# Altium project PS-010 Main.PrjPcb (part 1 of 2)
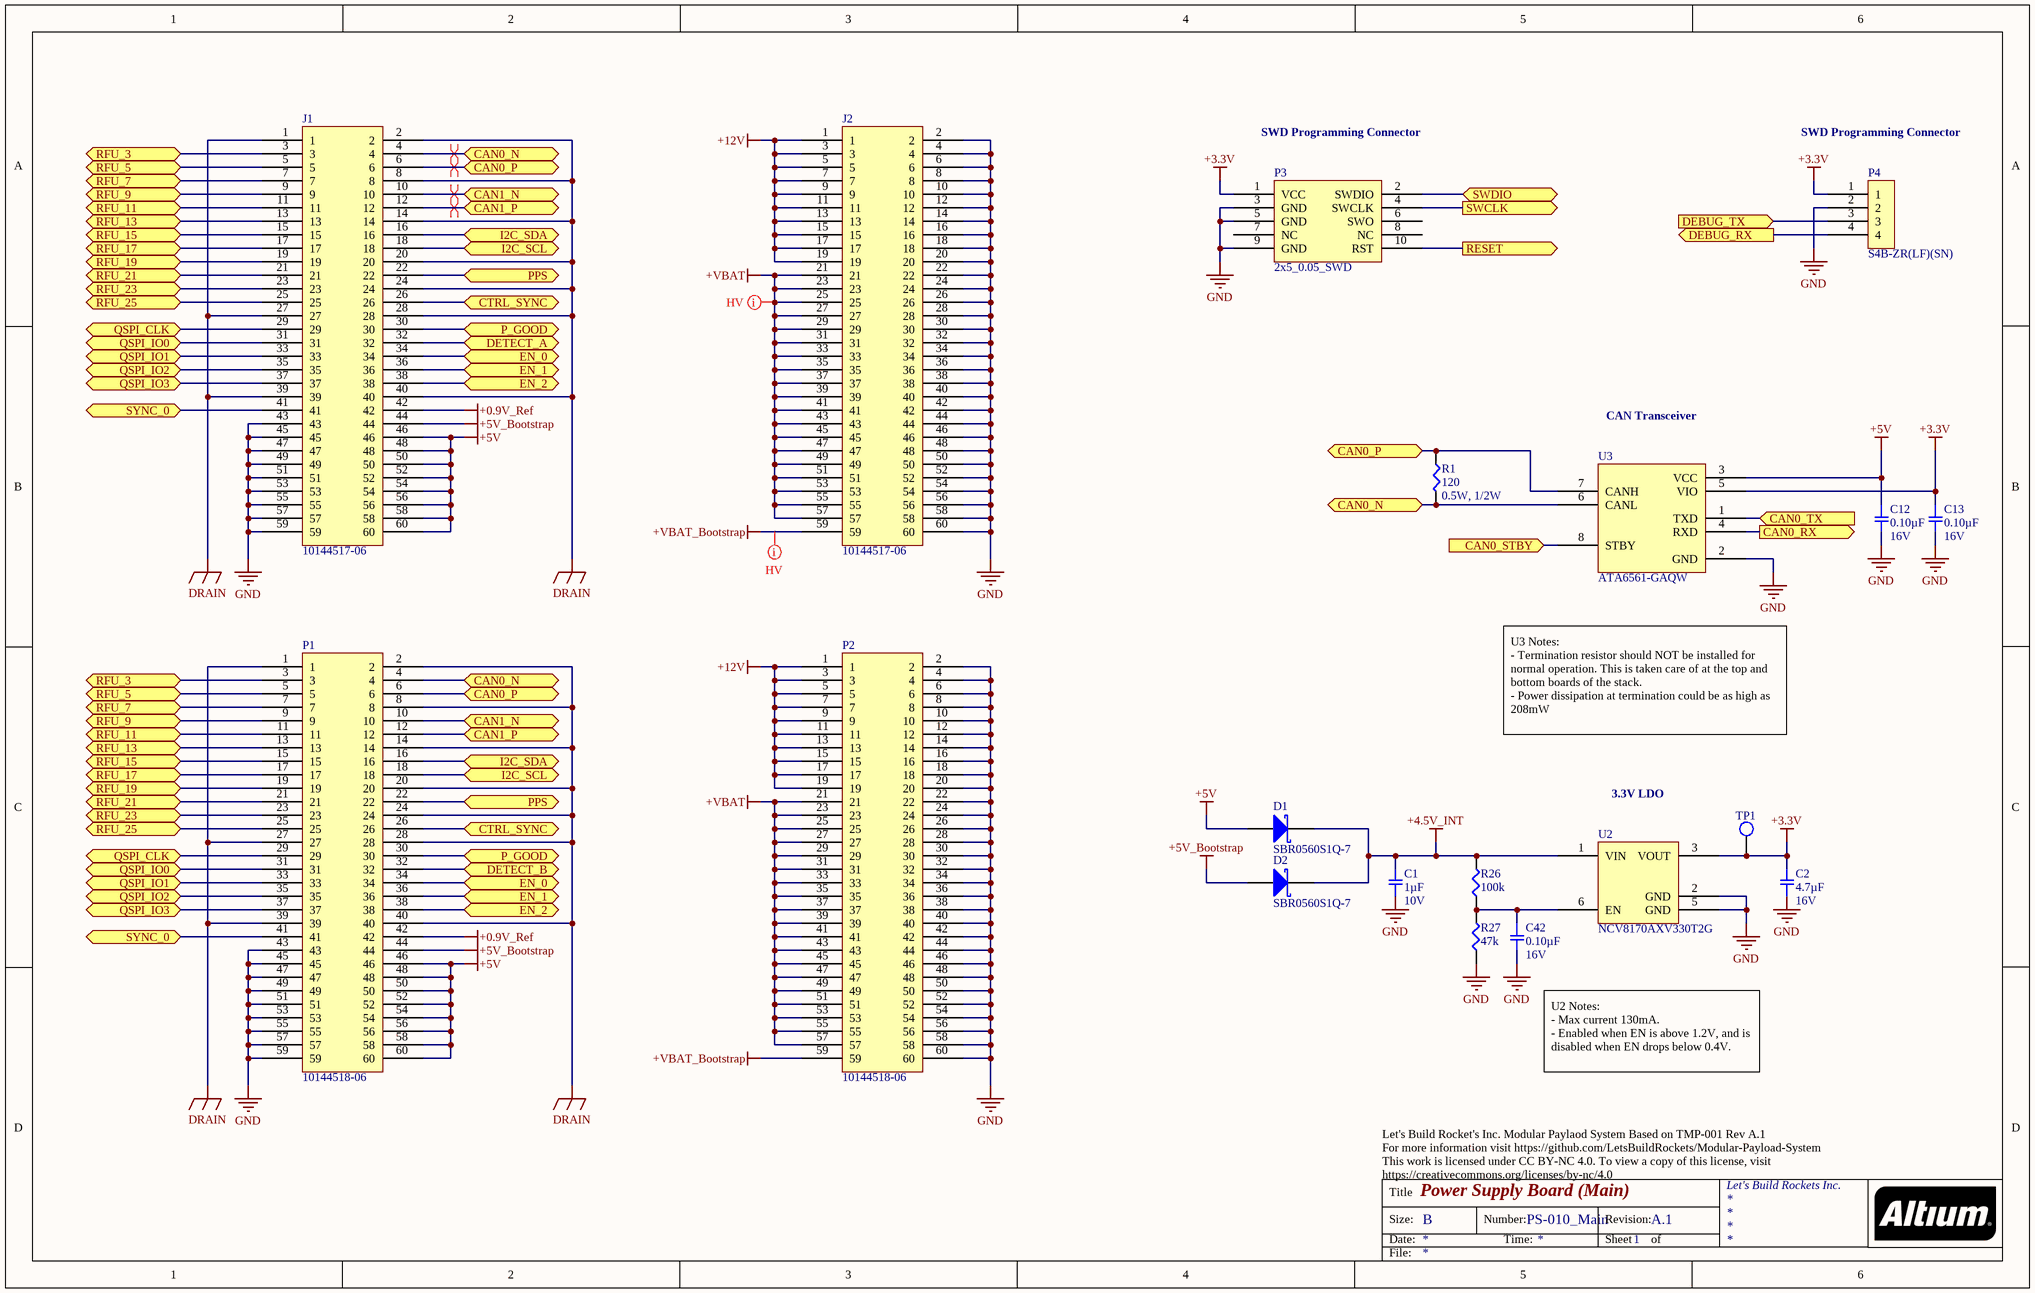
[diagram p0: Sheet1.SchDoc]
Title: Power Supply Board (Main); Revision: A.1; Organization: Let's Build Rockets Inc.; DocumentNumber: PS-010_Main
6 sheets, 144 parts. Net scope: flat (ports and power ports of the same name join across sheets).
Board file: PS-010 Main.PcbDoc
Sheets:
  Sheet1.SchDoc
  Sheet2.SchDoc
  Sheet3.SchDoc
  Sheet4.SchDoc
  Sheet5.SchDoc
  Sheet6.SchDoc

## Sheet Sheet1.SchDoc: Power Supply Board (Main)
size B; Organization: Let's Build Rockets Inc.; DocumentNumber: PS-010_Main; Revision: A.1; SheetNumber: 1

### Parts
C1  1µF  Voltage: 10V  [SMD-0402C]
C2  4.7µF  Voltage: 16V  [SMD-0805C]
C12  0.10µF  Voltage: 16V  [SMD-0402C]
C13  0.10µF  Voltage: 16V  [SMD-0402C]
C42  0.10µF  Voltage: 16V  [SMD-0402C]
D1  SBR0560S1Q-7  [SOD123]
D2  SBR0560S1Q-7  [SOD123]
J1  10144517-06  [10144517-062802LF]
J2  10144517-06  [10144517-062802LF]
P1  10144518-06  [10144518-064802LF]
P2  10144518-06  [10144518-064802LF]
P3  2x5_0.05_SWD  [2x5_0.05_R]
P4  S4B-ZR(LF)(SN)  [S4B-ZR(LF)(SN)]
R1  120  Power (Watts): 0.5W, 1/2W  [SMD-0805-RES]
R26  100k  [SMD-0402-RES]
R27  47k  [SMD-0402-RES]
TP1  TP  [TP_SMD_40]  (value not drawn)  (no BOM)
U2  NCV8170AXV330T2G  [SOTFL50P160X60-6N]
U3  ATA6561-GAQW  [SOIC127P600X175-8N]

### Ports
CAN0_N (bidir), CAN0_P (bidir), CAN0_RX (out), CAN0_STBY (in), CAN0_TX (in), CAN1_N (bidir), CAN1_P (bidir), CTRL_SYNC (bidir), DEBUG_RX (out), DEBUG_TX (in), DETECT_A (bidir), DETECT_B (bidir), EN_0 (bidir), EN_1 (bidir), EN_2 (bidir), I2C_SCL (bidir), I2C_SDA (bidir), P_GOOD (bidir), PPS (bidir), QSPI_CLK (bidir), QSPI_IO0 (bidir), QSPI_IO1 (bidir), QSPI_IO2 (bidir), QSPI_IO3 (bidir), RESET (out), RFU_3 (bidir), RFU_5 (bidir), RFU_7 (bidir), RFU_9 (bidir), RFU_11 (bidir), RFU_13 (bidir), RFU_15 (bidir), RFU_17 (bidir), RFU_19 (bidir), RFU_21 (bidir), RFU_23 (bidir), RFU_25 (bidir), SWCLK (out), SWDIO (bidir), SYNC_0 (bidir)

### Nets
+0.9V_Ref: J1.42 P1.42
+3.3V: C2.2 C13.1 P3.1(VCC) P4.1 TP1.1 U2.3(VOUT) U3.5(VIO)
+4.5V_INT: C1.2 D1.K D2.K R26.2 U2.1(VIN)
+5V: C12.1 D1.A J1.46 J1.48 J1.50 J1.52 J1.54 J1.56 J1.58 J1.60 P1.46 P1.48 P1.50 P1.52 P1.54 P1.56 P1.58 P1.60 U3.3(VCC)
+5V_Bootstrap: D2.A J1.44 P1.44
+12V: J2.1 J2.3 J2.5 J2.7 J2.9 J2.11 J2.13 J2.15 J2.17 J2.19 P2.1 P2.3 P2.5 P2.7 P2.9 P2.11 P2.13 P2.15 P2.17 P2.19
+VBAT: J2.21 J2.23 J2.25 J2.27 J2.29 J2.31 J2.33 J2.35 J2.37 J2.39 J2.41 J2.43 J2.45 J2.47 J2.49 J2.51 J2.53 J2.55 J2.57 P2.21 P2.23 P2.25 P2.27 P2.29 P2.31 P2.33 P2.35 P2.37 P2.39 P2.41 P2.43 P2.45 P2.47 P2.49 P2.51 P2.53 P2.55 P2.57
+VBAT_Bootstrap: J2.59 P2.59
DRAIN: J1.1 J1.2 J1.8 J1.14 J1.20 J1.24 J1.27 J1.28 J1.39 J1.40 P1.1 P1.2 P1.8 P1.14 P1.20 P1.24 P1.27 P1.28 P1.39 P1.40
GND: C1.1 C2.1 C12.2 C13.2 C42.2 J1.43 J1.45 J1.47 J1.49 J1.51 J1.53 J1.55 J1.57 J1.59 J2.2 J2.4 J2.6 J2.8 J2.10 J2.12 J2.14 J2.16 J2.18 J2.20 J2.22 J2.24 J2.26 J2.28 J2.30 J2.32 J2.34 J2.36 J2.38 J2.40 J2.42 J2.44 J2.46 J2.48 J2.50 J2.52 J2.54 J2.56 J2.58 J2.60 P1.43 P1.45 P1.47 P1.49 P1.51 P1.53 P1.55 P1.57 P1.59 P2.2 P2.4 P2.6 P2.8 P2.10 P2.12 P2.14 P2.16 P2.18 P2.20 P2.22 P2.24 P2.26 P2.28 P2.30 P2.32 P2.34 P2.36 P2.38 P2.40 P2.42 P2.44 P2.46 P2.48 P2.50 P2.52 P2.54 P2.56 P2.58 P2.60 P3.3(GND) P3.5(GND) P3.9(GND) P4.2 R27.1 U2.2(GND) U2.5(GND) U3.2(GND)
CAN0_N: J1.4 P1.4 R1.2 U3.6(CANL) ; port CAN0_N
CAN0_P: J1.6 P1.6 R1.1 U3.7(CANH) ; port CAN0_P
CAN0_RX: U3.4(RXD) ; port CAN0_RX
CAN0_STBY: U3.8(STBY) ; port CAN0_STBY
CAN0_TX: U3.1(TXD) ; port CAN0_TX
CAN1_N: J1.10 P1.10 ; port CAN1_N
CAN1_P: J1.12 P1.12 ; port CAN1_P
CTRL_SYNC: J1.26 P1.26 ; port CTRL_SYNC
DEBUG_RX: P4.4 ; port DEBUG_RX
DEBUG_TX: P4.3 ; port DEBUG_TX
DETECT_A: J1.32 ; port DETECT_A
DETECT_B: P1.32 ; port DETECT_B
EN_0: J1.34 P1.34 ; port EN_0
EN_1: J1.36 P1.36 ; port EN_1
EN_2: J1.38 P1.38 ; port EN_2
I2C_SCL: J1.18 P1.18 ; port I2C_SCL
I2C_SDA: J1.16 P1.16 ; port I2C_SDA
P_GOOD: J1.30 P1.30 ; port P_GOOD
PPS: J1.22 P1.22 ; port PPS
QSPI_CLK: J1.29 P1.29 ; port QSPI_CLK
QSPI_IO0: J1.31 P1.31 ; port QSPI_IO0
QSPI_IO1: J1.33 P1.33 ; port QSPI_IO1
QSPI_IO2: J1.35 P1.35 ; port QSPI_IO2
QSPI_IO3: J1.37 P1.37 ; port QSPI_IO3
RESET: P3.10(RST) ; port RESET
RFU_3: J1.3 P1.3 ; port RFU_3
RFU_5: J1.5 P1.5 ; port RFU_5
RFU_7: J1.7 P1.7 ; port RFU_7
RFU_9: J1.9 P1.9 ; port RFU_9
RFU_11: J1.11 P1.11 ; port RFU_11
RFU_13: J1.13 P1.13 ; port RFU_13
RFU_15: J1.15 P1.15 ; port RFU_15
RFU_17: J1.17 P1.17 ; port RFU_17
RFU_19: J1.19 P1.19 ; port RFU_19
RFU_21: J1.21 P1.21 ; port RFU_21
RFU_23: J1.23 P1.23 ; port RFU_23
RFU_25: J1.25 P1.25 ; port RFU_25
SWCLK: P3.4(SWCLK) ; port SWCLK
SWDIO: P3.2(SWDIO) ; port SWDIO
SYNC_0: J1.41 P1.41 ; port SYNC_0
NetC42_1: C42.1 R26.1 R27.2 U2.6(EN)

Not connected (* = marked no-connect by the designer): P3 6(SWO) 7(NC) 8(NC)

### Layout directives
differential pair: CAN0_N, CAN0_P, CAN1_N, CAN1_P
net class HIghVoltage: +VBAT, +VBAT_Bootstrap

### Notes on the sheet
- SWD Programming Connector
- CAN Transceiver
- U3 Notes:
  - Termination resistor should NOT be installed for normal operation. This is taken care of at the top and bottom boards of the stack.
  - Power dissipation at termination could be as high as 208mW
- 3.3V LDO
- (near C42) U2 Notes:
  - Max current 130mA.
  - Enabled when EN is above 1.2V, and is disabled when EN drops below 0.4V.
- Let's Build Rocket's Inc. Modular Paylaod System Based on TMP-001 Rev A.1
  For more information visit https://github.com/LetsBuildRockets/Modular-Payload-System
  This work is licensed under CC BY-NC 4.0. To view a copy of this license, visit https://creativecommons.org/licenses/by-nc/4.0
- Title
- Size:
- Date:
- B
- Number:
- Time:
- Revision:
- Sheet
- of
- File:

### Library data of the parts
C1 = GCM155C71A105KE38D: CAP CER 1UF 10V X7S 0402; Manufacturer: Murata Electronics North America; Factory Stock: 0; Unit Price (USD): 0.12; Minimum Quantity: 1; Tolerance: ±10%; Datasheets: http://www.murata.com/~/media/webrenewal/support/library/catalog/products/capacitor/mlcc/c03e.ashx; Image: //media.digikey.com/Renders/Murata%20Renders/ZRB-SERIES-0402.jpg; Digi-Key Part Number: 490-13409-1-ND; Part Number: GCM155C71A105KE38D; Quantity Available: 7240; @ qty: 0; Packaging: Cut Tape (CT); Series: GCM; Part Status: Active; Value: 1µF; Temperature Coefficient: X7S; Operating Temperature: -55°C ~ 125°C; Features: -; Ratings: AEC-Q200; Applications: Automotive; Mounting Type: Surface Mount, MLCC; Package / Case: 0402 (1005 Metric); Size / Dimension: 0.039" L x 0.020" W (1.00mm x 0.50mm); Height - Seated (Max): -; Thickness (Max): 0.022" (0.55mm); Lead Spacing: -; Lead Style: -
C2 = GCJ21BR71C475KA01L: CAP CER 4.7UF 16V X7R 0805; Manufacturer: Murata Electronics North America; Factory Stock: 0; Unit Price (USD): 0.44; Minimum Quantity: 1; Tolerance: ±10%; Datasheets: http://www.murata.com/~/media/webrenewal/support/library/catalog/products/capacitor/mlcc/c03e.ashx; Image: //media.digikey.com/Renders/Murata%20Renders/0805%20(2012%20Metric)%20.85mm.jpg; Digi-Key Part Number: 490-10557-1-ND; Part Number: GCJ21BR71C475KA01L; Quantity Available: 53217; @ qty: 0; Packaging: Cut Tape (CT); Series: GCJ; Part Status: Active; Value: 4.7µF; Temperature Coefficient: X7R; Operating Temperature: -55°C ~ 125°C; Features: Soft Termination; Ratings: AEC-Q200; Applications: Automotive, Boardflex Sensitive; Mounting Type: Surface Mount, MLCC; Package / Case: 0805 (2012 Metric); Size / Dimension: 0.079" L x 0.049" W (2.00mm x 1.25mm); Height - Seated (Max): -; Thickness (Max): 0.057" (1.45mm); Lead Spacing: -; Lead Style: -
C12 C13 C42 = GCM155R71C104KA55D: CAP CER 0.1UF 16V X7R 0402; Manufacturer: Murata Electronics North America; Factory Stock: 0; Unit Price (USD): 0.1; Minimum Quantity: 1; Tolerance: ±10%; Datasheets: http://www.murata.com/~/media/webrenewal/support/library/catalog/products/capacitor/mlcc/c03e.ashx; Image: //media.digikey.com/Renders/Murata%20Renders/ZRB-SERIES-0402.jpg; Digi-Key Part Number: 490-4759-1-ND; Part Number: GCM155R71C104KA55D; Quantity Available: 734194; @ qty: 0; Packaging: Cut Tape (CT); Series: GCM; Part Status: Active; Value: 0.10µF; Temperature Coefficient: X7R; Operating Temperature: -55°C ~ 125°C; Features: -; Ratings: AEC-Q200; Applications: Automotive; Mounting Type: Surface Mount, MLCC; Package / Case: 0402 (1005 Metric); Size / Dimension: 0.039" L x 0.020" W (1.00mm x 0.50mm); Height - Seated (Max): -; Thickness (Max): 0.022" (0.55mm); Lead Spacing: -; Lead Style: -
R1 = ERJ-P6WJ121V: RES SMD 120 OHM 5% 1/2W 0805; Manufacturer: Panasonic Electronic Components; Factory Stock: 0; Unit Price (USD): 0.08237; @ qty: 1500; Minimum Quantity: 1; Temperature Coefficient: ±200ppm/°C; Part Number: ERJ-P6WJ121V; Datasheets: https://industrial.panasonic.com/cdbs/www-data/pdf/RDA0000/AOA0000C243.pdf; Image: //media.digikey.com/Renders/Panasonic%20Renders/ERJ-0805%20Pkg.jpg; Digi-Key Part Number: P16943CT-ND; Quantity Available: 4133; Packaging: Cut Tape (CT); Series: ERJ; Part Status: Active; Value: 120; Tolerance: ±5%; Composition: Thick Film; Features: Automotive AEC-Q200, Pulse Withstanding; Operating Temperature: -55°C ~ 155°C; Package / Case: 0805 (2012 Metric); Supplier Device Package: 0805; Size / Dimension: 0.079" L x 0.049" W (2.00mm x 1.25mm); Height - Seated (Max): 0.030" (0.75mm); Number of Terminations: 2; Failure Rate: -
R26 = ERJ-2GEJ104X: RES SMD 100K OHM 5% 1/10W 0402; Manufacturer: Panasonic Electronic Components; Factory Stock: 0; Unit Price (USD): 0.00350; @ qty: 1500; Minimum Quantity: 1; Power (Watts): 0.1W, 1/10W; Temperature Coefficient: ±200ppm/°C; Part Number: ERJ-2GEJ104X; Datasheets: http://industrial.panasonic.com/www-cgi/jvcr13pz.cgi?E+PZ+3+AOA0001+ERJ2GEJ104X+7+WW; Image: //media.digikey.com/Photos/Panasonic%20Photos/ERJ-PA2-Series.jpg; Digi-Key Part Number: P100KJCT-ND; Quantity Available: 2387986; Packaging: Cut Tape (CT); Series: ERJ; Part Status: Active; Value: 100k; Tolerance: ±5%; Composition: Thick Film; Features: Automotive AEC-Q200; Operating Temperature: -55°C ~ 155°C; Package / Case: 0402 (1005 Metric); Supplier Device Package: 0402; Size / Dimension: 0.039" L x 0.020" W (1.00mm x 0.50mm); Height - Seated (Max): 0.016" (0.40mm); Number of Terminations: 2; Failure Rate: -
R27 = ERJ-2GEJ473X: RES SMD 47K OHM 5% 1/10W 0402; Manufacturer: Panasonic Electronic Components; Factory Stock: 0; Unit Price (USD): 0.00350; @ qty: 1500; Minimum Quantity: 1; Power (Watts): 0.1W, 1/10W; Temperature Coefficient: ±200ppm/°C; Part Number: ERJ-2GEJ473X; Datasheets: http://industrial.panasonic.com/www-cgi/jvcr13pz.cgi?E+PZ+3+AOA0001+ERJ2GEJ473X+7+WW; Image: //media.digikey.com/Photos/Panasonic%20Photos/ERJ-PA2-Series.jpg; Digi-Key Part Number: P47KJCT-ND; Quantity Available: 5182645; Packaging: Cut Tape (CT); Series: ERJ; Part Status: Active; Value: 47k; Tolerance: ±5%; Composition: Thick Film; Features: Automotive AEC-Q200; Operating Temperature: -55°C ~ 155°C; Package / Case: 0402 (1005 Metric); Supplier Device Package: 0402; Size / Dimension: 0.039" L x 0.020" W (1.00mm x 0.50mm); Height - Seated (Max): 0.016" (0.40mm); Number of Terminations: 2; Failure Rate: -

## Sheet Sheet2.SchDoc: Power Supply Board (Main)
size B; Organization: Let's Build Rockets Inc.; DocumentNumber: PS-010_Main; Revision: A.1; SheetNumber: 2
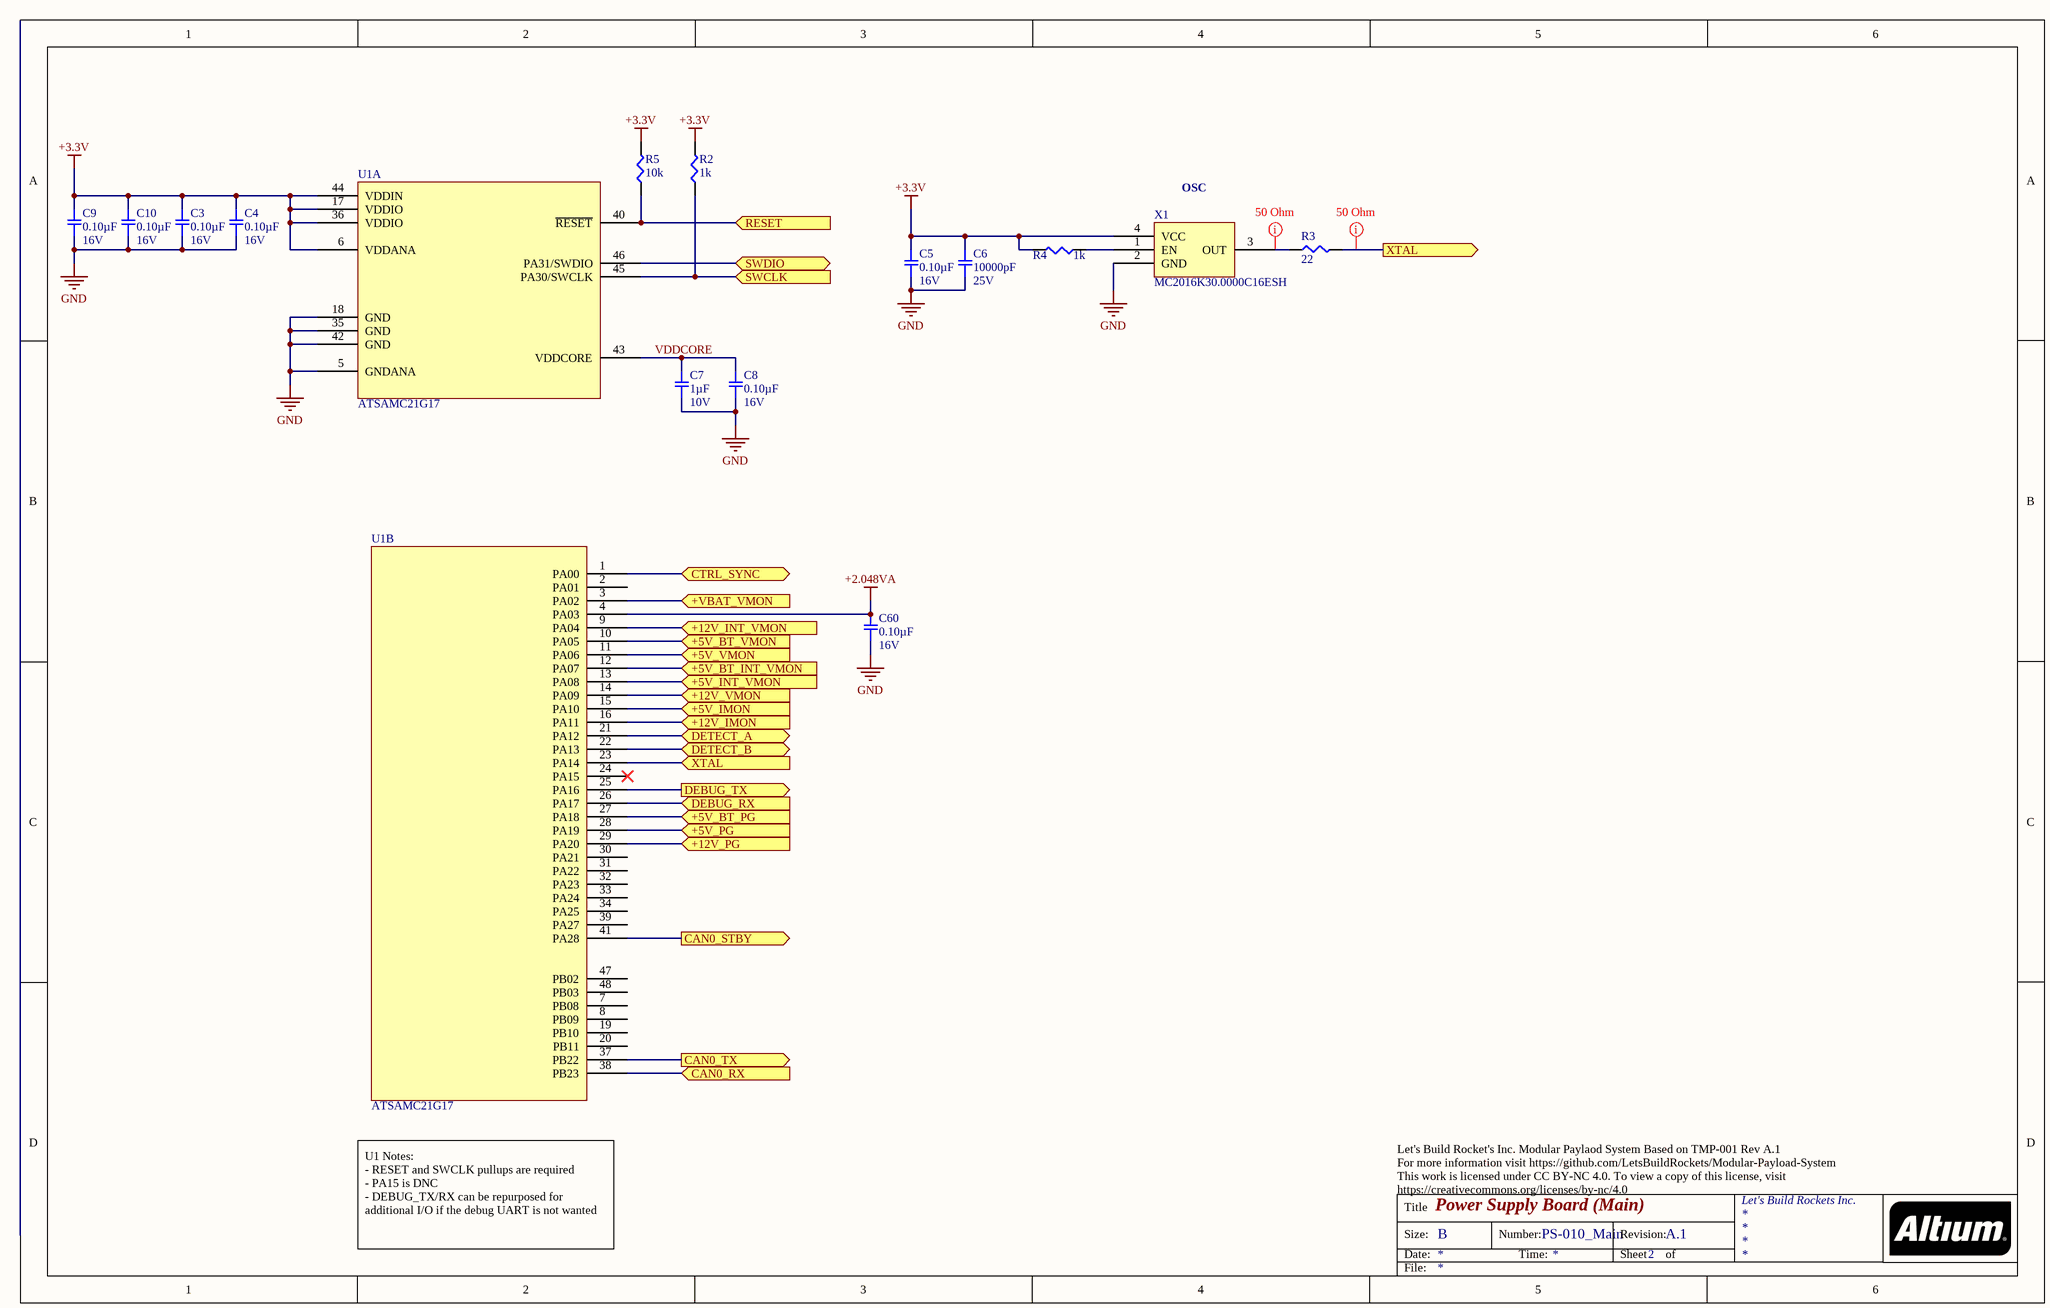
[diagram p1: Sheet2.SchDoc]

### Parts
C3  0.10µF  Voltage: 16V  [SMD-0402C]
C4  0.10µF  Voltage: 16V  [SMD-0402C]
C5  0.10µF  Voltage: 16V  [SMD-0402C]
C6  10000pF  Voltage: 25V  [SMD-0402C]
C7  1µF  Voltage: 10V  [SMD-0402C]
C8  0.10µF  Voltage: 16V  [SMD-0402C]
C9  0.10µF  Voltage: 16V  [SMD-0402C]
C10  0.10µF  Voltage: 16V  [SMD-0402C]
C60  0.10µF  Voltage: 16V  [SMD-0402C]
R2  1k  [SMD-0402-RES]
R3  22  [SMD-0402-RES]
R4  1k  [SMD-0402-RES]
R5  10k  [SMD-0402-RES]
U1  ATSAMC21G17  [TSQFP50P900X900X120-48N]  (parts A,B of 2)
X1  MC2016K30.0000C16ESH  [MC2016]

### Ports
+5V_BT_INT_VMON (in), +5V_BT_PG (in), +5V_BT_VMON (in), +5V_IMON (in), +5V_INT_VMON (in), +5V_PG (in), +5V_VMON (in), +12V_IMON (in), +12V_INT_VMON (in), +12V_PG (in), +12V_VMON (in), +VBAT_VMON (in), CAN0_RX (in), CAN0_STBY (out), CAN0_TX (out), CTRL_SYNC (bidir), DEBUG_RX (in), DEBUG_TX (out), DETECT_A (bidir), DETECT_B (bidir), RESET (in), SWCLK (in), SWDIO (bidir), XTAL (in), XTAL (out)

### Nets
+2.048VA: C60.2 U1.4(PA03)
+3.3V: C3.2 C4.2 C5.2 C6.2 C9.2 C10.2 R2.2 R4.2 R5.2 U1.6(VDDANA) U1.17(VDDIO) U1.36(VDDIO) U1.44(VDDIN) X1.4(VCC)
GND: C3.1 C4.1 C5.1 C6.1 C7.1 C8.1 C9.1 C10.1 C60.1 U1.5(GNDANA) U1.18(GND) U1.35(GND) U1.42(GND) X1.2(GND)
+5V_BT_INT_VMON: U1.12(PA07) ; port +5V_BT_INT_VMON
+5V_BT_PG: U1.27(PA18) ; port +5V_BT_PG
+5V_BT_VMON: U1.10(PA05) ; port +5V_BT_VMON
+5V_IMON: U1.15(PA10) ; port +5V_IMON
+5V_INT_VMON: U1.13(PA08) ; port +5V_INT_VMON
+5V_PG: U1.28(PA19) ; port +5V_PG
+5V_VMON: U1.11(PA06) ; port +5V_VMON
+12V_IMON: U1.16(PA11) ; port +12V_IMON
+12V_INT_VMON: U1.9(PA04) ; port +12V_INT_VMON
+12V_PG: U1.29(PA20) ; port +12V_PG
+12V_VMON: U1.14(PA09) ; port +12V_VMON
+VBAT_VMON: U1.3(PA02) ; port +VBAT_VMON
CAN0_RX: U1.38(PB23) ; port CAN0_RX
CAN0_STBY: U1.41(PA28) ; port CAN0_STBY
CAN0_TX: U1.37(PB22) ; port CAN0_TX
CTRL_SYNC: U1.1(PA00) ; port CTRL_SYNC
DEBUG_RX: U1.26(PA17) ; port DEBUG_RX
DEBUG_TX: U1.25(PA16) ; port DEBUG_TX
DETECT_A: U1.21(PA12) ; port DETECT_A
DETECT_B: U1.22(PA13) ; port DETECT_B
RESET: R5.1 U1.40(~{RESET}) ; port RESET
SWCLK: R2.1 U1.45(PA30/SWCLK) ; port SWCLK
SWDIO: U1.46(PA31/SWDIO) ; port SWDIO
VDDCORE: C7.2 C8.2 U1.43(VDDCORE)
XTAL: R3.2 U1.23(PA14) ; port XTAL
NetR3_1: R3.1 X1.3(OUT)
NetR4_1: R4.1 X1.1(EN)

Not connected (* = marked no-connect by the designer): U1 2(PA01) 7(PB08) 8(PB09) 19(PB10) 20(PB11) 24(PA15)* 30(PA21) 31(PA22) 32(PA23) 33(PA24) 34(PA25) 39(PA27) 47(PB02) 48(PB03)

### Layout directives
rule Width Constraint [Pref Impedance = 50.00ohms    Min Impedance = 50.00ohms    Max Impedance = 50.00ohms]: NetR3_1, XTAL

### Notes on the sheet
- (near X1) OSC
- Let's Build Rocket's Inc. Modular Paylaod System Based on TMP-001 Rev A.1
  For more information visit https://github.com/LetsBuildRockets/Modular-Payload-System
  This work is licensed under CC BY-NC 4.0. To view a copy of this license, visit https://creativecommons.org/licenses/by-nc/4.0
- U1 Notes:
  - RESET and SWCLK pullups are required
  - PA15 is DNC
  - DEBUG_TX/RX can be repurposed for additional I/O if the debug UART is not wanted
- Title
- Size:
- Date:
- B
- Number:
- Time:
- Revision:
- Sheet
- of
- File:

### Library data of the parts
C3-C5 C8-C10 C60 = GCM155R71C104KA55D: as C12 on sheet Sheet1; Datasheets: http://www.murata.com/~/media/webrenewal/support/library/catalog/products/capacitor/mlcc/c03e.ashx; Image: //media.digikey.com/Renders/Murata%20Renders/ZRB-SERIES-0402.jpg; Digi-Key Part Number: 490-4759-1-ND; Part Number: GCM155R71C104KA55D; Quantity Available: 734194; @ qty: 0; Packaging: Cut Tape (CT); Series: GCM; Part Status: Active; Value: 0.10µF; Temperature Coefficient: X7R; Operating Temperature: -55°C ~ 125°C; Features: -; Ratings: AEC-Q200; Applications: Automotive; Mounting Type: Surface Mount, MLCC; Package / Case: 0402 (1005 Metric); Size / Dimension: 0.039" L x 0.020" W (1.00mm x 0.50mm); Height - Seated (Max): -; Thickness (Max): 0.022" (0.55mm); Lead Spacing: -; Lead Style: -
C6 = GCM155R71E103KA37D: CAP CER 10000PF 25V X7R 0402; Manufacturer: Murata Electronics North America; Factory Stock: 0; Unit Price (USD): 0.1; Minimum Quantity: 1; Tolerance: ±10%; Datasheets: http://www.murata.com/~/media/webrenewal/support/library/catalog/products/capacitor/mlcc/c03e.ashx; Image: //media.digikey.com/Renders/Murata%20Renders/ZRB-SERIES-0402.jpg; Digi-Key Part Number: 490-6043-1-ND; Part Number: GCM155R71E103KA37D; Quantity Available: 128782; @ qty: 0; Packaging: Cut Tape (CT); Series: GCM; Part Status: Active; Value: 10000pF; Temperature Coefficient: X7R; Operating Temperature: -55°C ~ 125°C; Features: -; Ratings: AEC-Q200; Applications: Automotive; Mounting Type: Surface Mount, MLCC; Package / Case: 0402 (1005 Metric); Size / Dimension: 0.039" L x 0.020" W (1.00mm x 0.50mm); Height - Seated (Max): -; Thickness (Max): 0.022" (0.55mm); Lead Spacing: -; Lead Style: -
C7 = GCM155C71A105KE38D: as C1 on sheet Sheet1; Datasheets: http://www.murata.com/~/media/webrenewal/support/library/catalog/products/capacitor/mlcc/c03e.ashx; Image: //media.digikey.com/Renders/Murata%20Renders/ZRB-SERIES-0402.jpg; Digi-Key Part Number: 490-13409-1-ND; Part Number: GCM155C71A105KE38D; Quantity Available: 7240; @ qty: 0; Packaging: Cut Tape (CT); Series: GCM; Part Status: Active; Value: 1µF; Temperature Coefficient: X7S; Operating Temperature: -55°C ~ 125°C; Features: -; Ratings: AEC-Q200; Applications: Automotive; Mounting Type: Surface Mount, MLCC; Package / Case: 0402 (1005 Metric); Size / Dimension: 0.039" L x 0.020" W (1.00mm x 0.50mm); Height - Seated (Max): -; Thickness (Max): 0.022" (0.55mm); Lead Spacing: -; Lead Style: -
R2 R4 = ERJ-2GEJ102X: RES SMD 1K OHM 5% 1/10W 0402; Manufacturer: Panasonic Electronic Components; Factory Stock: 0; Unit Price (USD): 0.00350; @ qty: 1500; Minimum Quantity: 1; Power (Watts): 0.1W, 1/10W; Temperature Coefficient: ±200ppm/°C; Part Number: ERJ-2GEJ102X; Datasheets: http://industrial.panasonic.com/www-cgi/jvcr13pz.cgi?E+PZ+3+AOA0001+ERJ2GEJ102X+7+WW; Image: //media.digikey.com/Photos/Panasonic%20Photos/ERJ-PA2-Series.jpg; Digi-Key Part Number: P1.0KJCT-ND; Quantity Available: 1939857; Packaging: Cut Tape (CT); Series: ERJ; Part Status: Active; Value: 1k; Tolerance: ±5%; Composition: Thick Film; Features: Automotive AEC-Q200; Operating Temperature: -55°C ~ 155°C; Package / Case: 0402 (1005 Metric); Supplier Device Package: 0402; Size / Dimension: 0.039" L x 0.020" W (1.00mm x 0.50mm); Height - Seated (Max): 0.016" (0.40mm); Number of Terminations: 2; Failure Rate: -
R3 = ERJ-2RKF22R0X: RES SMD 22 OHM 1% 1/10W 0402; Manufacturer: Panasonic Electronic Components; Factory Stock: 0; Unit Price (USD): 0.00496; @ qty: 1500; Minimum Quantity: 1; Power (Watts): 0.1W, 1/10W; Temperature Coefficient: ±100ppm/°C; Part Number: ERJ-2RKF22R0X; Datasheets: http://industrial.panasonic.com/www-cgi/jvcr13pz.cgi?E+PZ+3+AOA0002+ERJ2RKF22R0X+7+WW; Image: //media.digikey.com/Photos/Panasonic%20Photos/ERJ-PA2-Series.jpg; Digi-Key Part Number: P22.0LCT-ND; Quantity Available: 620432; Packaging: Cut Tape (CT); Series: ERJ; Part Status: Active; Value: 22; Tolerance: ±1%; Composition: Thick Film; Features: Automotive AEC-Q200; Operating Temperature: -55°C ~ 155°C; Package / Case: 0402 (1005 Metric); Supplier Device Package: 0402; Size / Dimension: 0.039" L x 0.020" W (1.00mm x 0.50mm); Height - Seated (Max): 0.016" (0.40mm); Number of Terminations: 2; Failure Rate: -
R5 = ERJ-2GEJ103X: RES SMD 10K OHM 5% 1/10W 0402; Manufacturer: Panasonic Electronic Components; Factory Stock: 0; Unit Price (USD): 0.00350; @ qty: 1500; Minimum Quantity: 1; Power (Watts): 0.1W, 1/10W; Temperature Coefficient: ±200ppm/°C; Part Number: ERJ-2GEJ103X; Datasheets: http://industrial.panasonic.com/www-cgi/jvcr13pz.cgi?E+PZ+3+AOA0001+ERJ2GEJ103X+7+WW; Image: //media.digikey.com/Photos/Panasonic%20Photos/ERJ-PA2-Series.jpg; Digi-Key Part Number: P10KJCT-ND; Quantity Available: 2560215; Packaging: Cut Tape (CT); Series: ERJ; Part Status: Active; Value: 10k; Tolerance: ±5%; Composition: Thick Film; Features: Automotive AEC-Q200; Operating Temperature: -55°C ~ 155°C; Package / Case: 0402 (1005 Metric); Supplier Device Package: 0402; Size / Dimension: 0.039" L x 0.020" W (1.00mm x 0.50mm); Height - Seated (Max): 0.016" (0.40mm); Number of Terminations: 2; Failure Rate: -
U1 = ATSAMC21G17: Unit Price (USD): 2.35
X1 = MC2016K30.0000C16ESH: Unit Price (USD): 2.37

## Sheet Sheet3.SchDoc: Power Supply Board (Main)
size B; Organization: Let's Build Rockets Inc.; DocumentNumber: PS-010_Main; Revision: A.1; SheetNumber: 2
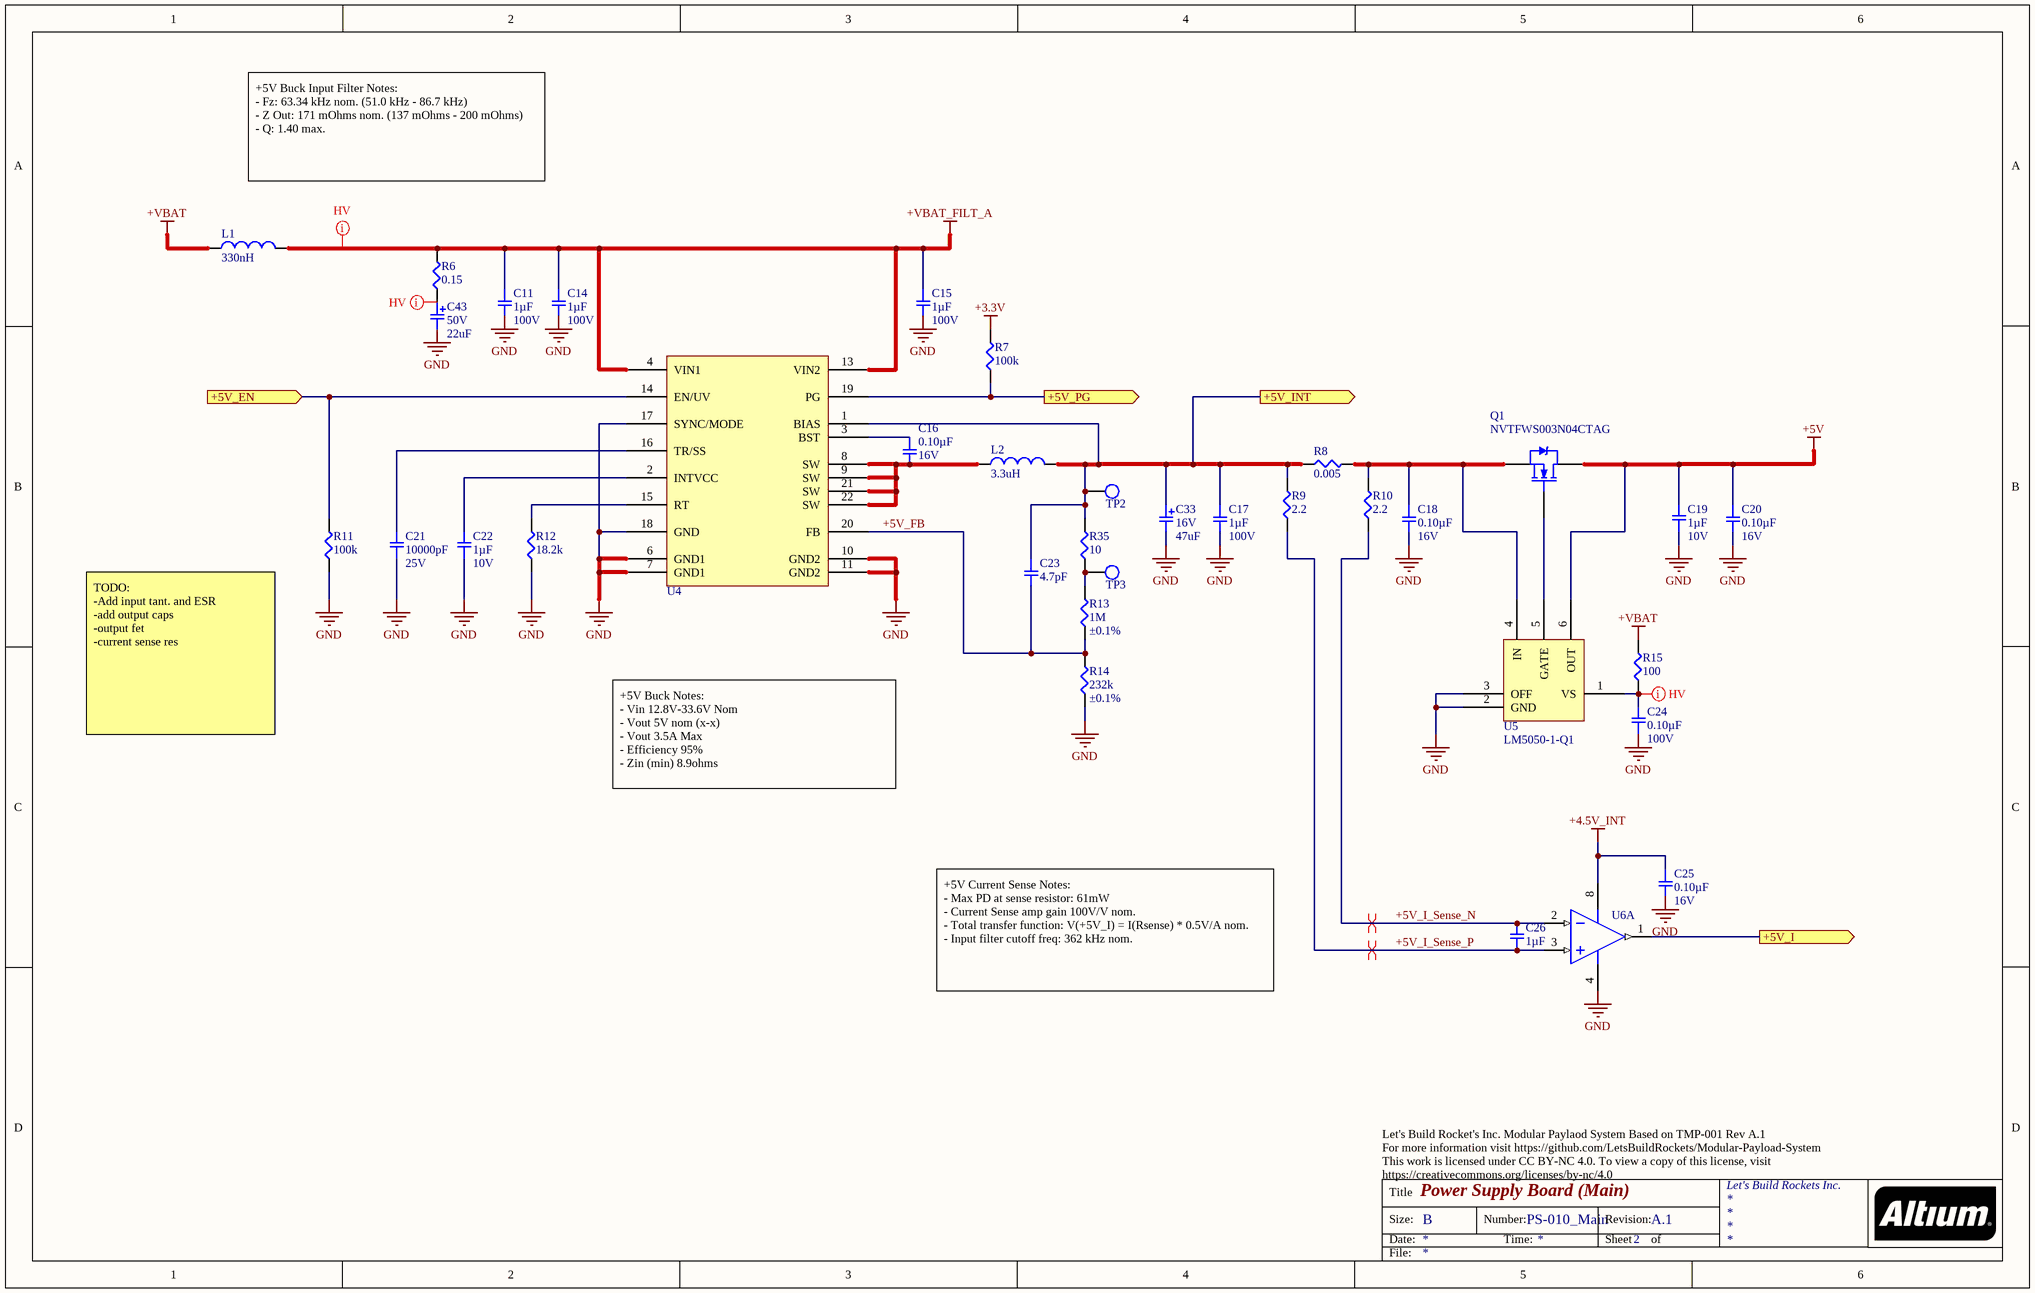
[diagram p2: Sheet3.SchDoc]

### Parts
C11  1µF  Voltage: 100V  [SMD-0805C]
C14  1µF  Voltage: 100V  [SMD-0805C]
C15  1µF  Voltage: 100V  [SMD-0805C]
C16  0.10µF  Voltage: 16V  [SMD-0402C]
C17  1µF  Voltage: 100V  [SMD-0805C]
C18  0.10µF  Voltage: 16V  [SMD-0402C]
C19  1µF  Voltage: 10V  [SMD-0402C]
C20  0.10µF  Voltage: 16V  [SMD-0402C]
C21  10000pF  Voltage: 25V  [SMD-0402C]
C22  1µF  Voltage: 10V  [SMD-0402C]
C23  4.7pF  [SMD-0402C]
C24  0.10µF  Voltage: 100V  [SMD-0603C]
C25  0.10µF  Voltage: 16V  [SMD-0402C]
C26  1µF  [SMD-0402C]
C33  value 47uF  Voltage: 16V  [KEMET W - CAPMP7343X15N]  (hidden comment: T521W476M016ATE045)
C43  value 22uF  Voltage: 50V  [KEMET D - CAPMP7343X31N]  (hidden comment: T521D226M050ATE090)
L1  value 330nH  [INDM4040X21N (XGL4020)]  (hidden comment: XGL4020-331ME)
L2  value 3.3uH  [INDM7050X50N (Wurth)]  (hidden comment: 744314330)
Q1  NVTFWS003N04CTAG  [DFN065P305X80-8N]
R6  0.15  [SMD-0603-RES]
R7  100k  [SMD-0402-RES]
R8  0.005  [SMD-0603-RES]
R9  2.2  [SMD-0603-RES]
R10  2.2  [SMD-0603-RES]
R11  100k  [SMD-0402-RES]
R12  18.2k  [SMD-0402-RES]
R13  1M  Tolerance: ±0.1%  [SMD-0805-RES]
R14  232k  Tolerance: ±0.1%  [SMD-0805-RES]
R15  100  [SMD-0402-RES]
R35  10  [SMD-0402-RES]
TP2  TP  [TP_SMD_40]  (value not drawn)  (no BOM)
TP3  TP  [TP_SMD_40]  (value not drawn)  (no BOM)
U4  LT8640  [QFN50P300X400X80_HS-21N (LT8640)]  (value not drawn)
U5  LM5050-1-Q1  [SOT95P280X110-6N]
U6  INA2180A3IDGKT  [TSOP65P490X110-8N]  (value not drawn)  (part A of 2)

### Ports
+5V_EN (in), +5V_I (out), +5V_INT (out), +5V_PG (out)

### Nets
+3.3V: R7.2
+4.5V_INT: C25.1 U6.8(VS)
+5V: C19.2 C20.1 Q1.D U5.6(OUT)
+VBAT: L1.1 R15.2
+VBAT_FILT_A: C11.1 C14.1 C15.1 L1.2 R6.2 U4.4(VIN1) U4.13(VIN2)
GND: C11.2 C14.2 C15.2 C17.2 C18.2 C19.1 C20.2 C21.1 C22.1 C24.1 C25.2 C33.2 C43.2 R11.1 R12.1 R14.1 U4.6(GND1) U4.7(GND1) U4.10(GND2) U4.11(GND2) U4.17(SYNC/MODE) U4.18(GND) U5.2(GND) U5.3(OFF) U6.4(GND)
+5V_EN: R11.2 U4.14(EN/UV) ; port +5V_EN
+5V_FB: C23.2 R13.1 R14.2 U4.20(FB)
+5V_I: U6.1(OUT1) ; port +5V_I
+5V_I_Sense_N: C26.2 R10.1 U6.2(IN-1)
+5V_I_Sense_P: C26.1 R9.1 U6.3(IN+1)
+5V_INT: C17.1 C23.1 C33.1 L2.2 R8.1 R9.2 R35.2 TP2.1 U4.1(BIAS) ; port +5V_INT
+5V_PG: R7.1 U4.19(PG) ; port +5V_PG
NetC16_1: C16.1 U4.3(BST)
NetC16_2: C16.2 L2.1 U4.8(SW) U4.9(SW) U4.21(SW) U4.22(SW)
NetC18_1: C18.1 Q1.S R8.2 R10.2 U5.4(IN)
NetC21_2: C21.2 U4.16(TR/SS)
NetC22_2: C22.2 U4.2(INTVCC)
NetC24_2: C24.2 R15.1 U5.1(VS)
NetC43_1: C43.1 R6.1
NetQ1_G: Q1.G U5.5(GATE)
NetR12_2: R12.2 U4.15(RT)
NetR13_2: R13.2 R35.1 TP3.1

### Layout directives
differential pair: +5V_I_Sense_N, +5V_I_Sense_P
net class HIghVoltage: +VBAT_FILT_A, NetC24_2, NetC43_1

### Notes on the sheet
- +5V Buck Input Filter Notes:
  - Fz: 63.34 kHz nom. (51.0 kHz - 86.7 kHz)
  - Z Out: 171 mOhms nom. (137 mOhms - 200 mOhms)
  - Q: 1.40 max.
- TODO:
  -Add input tant. and ESR
  -add output caps
  -output fet
  -current sense res
- +5V Buck Notes:
  - Vin 12.8V-33.6V Nom
  - Vout 5V nom (x-x)
  - Vout 3.5A Max
  - Efficiency 95%
  - Zin (min) 8.9ohms
- +5V Current Sense Notes:
  - Max PD at sense resistor: 61mW
  - Current Sense amp gain 100V/V nom.
  - Total transfer function: V(+5V_I) = I(Rsense) * 0.5V/A nom.
  - Input filter cutoff freq: 362 kHz nom.
- Let's Build Rocket's Inc. Modular Paylaod System Based on TMP-001 Rev A.1
  For more information visit https://github.com/LetsBuildRockets/Modular-Payload-System
  This work is licensed under CC BY-NC 4.0. To view a copy of this license, visit https://creativecommons.org/licenses/by-nc/4.0
- Title
- Size:
- Date:
- B
- Number:
- Time:
- Revision:
- Sheet
- of
- File:

### Library data of the parts
C11 C14 C15 C17 = GRJ21BC72A105KE11L: CAP CER 1UF 100V X7S 0805; Manufacturer: Murata Electronics North America; Factory Stock: 0; Unit Price (USD): 0.47; Minimum Quantity: 1; Tolerance: ±10%; Datasheets: http://www.murata.com/~/media/webrenewal/support/library/catalog/products/capacitor/mlcc/c02e.pdf; Image: //media.digikey.com/Renders/Murata%20Renders/0805%20(2012%20Metric)%20.85mm.jpg; Digi-Key Part Number: 490-10918-1-ND; Part Number: GRJ21BC72A105KE11L; Quantity Available: 16015; @ qty: 0; Packaging: Cut Tape (CT); Series: GRJ; Part Status: Active; Value: 1µF; Temperature Coefficient: X7S; Operating Temperature: -55°C ~ 125°C; Features: Soft Termination; Ratings: -; Applications: Boardflex Sensitive; Mounting Type: Surface Mount, MLCC; Package / Case: 0805 (2012 Metric); Size / Dimension: 0.079" L x 0.049" W (2.00mm x 1.25mm); Height - Seated (Max): -; Thickness (Max): 0.057" (1.45mm); Lead Spacing: -; Lead Style: -
C16 C18 C20 C25 = GCM155R71C104KA55D: as C12 on sheet Sheet1; Datasheets: http://www.murata.com/~/media/webrenewal/support/library/catalog/products/capacitor/mlcc/c03e.ashx; Image: //media.digikey.com/Renders/Murata%20Renders/ZRB-SERIES-0402.jpg; Digi-Key Part Number: 490-4759-1-ND; Part Number: GCM155R71C104KA55D; Quantity Available: 734194; @ qty: 0; Packaging: Cut Tape (CT); Series: GCM; Part Status: Active; Value: 0.10µF; Temperature Coefficient: X7R; Operating Temperature: -55°C ~ 125°C; Features: -; Ratings: AEC-Q200; Applications: Automotive; Mounting Type: Surface Mount, MLCC; Package / Case: 0402 (1005 Metric); Size / Dimension: 0.039" L x 0.020" W (1.00mm x 0.50mm); Height - Seated (Max): -; Thickness (Max): 0.022" (0.55mm); Lead Spacing: -; Lead Style: -
C19 C22 C26 = GCM155C71A105KE38D: as C1 on sheet Sheet1; Datasheets: http://www.murata.com/~/media/webrenewal/support/library/catalog/products/capacitor/mlcc/c03e.ashx; Image: //media.digikey.com/Renders/Murata%20Renders/ZRB-SERIES-0402.jpg; Digi-Key Part Number: 490-13409-1-ND; Part Number: GCM155C71A105KE38D; Quantity Available: 7240; @ qty: 0; Packaging: Cut Tape (CT); Series: GCM; Part Status: Active; Value: 1µF; Temperature Coefficient: X7S; Operating Temperature: -55°C ~ 125°C; Features: -; Ratings: AEC-Q200; Applications: Automotive; Mounting Type: Surface Mount, MLCC; Package / Case: 0402 (1005 Metric); Size / Dimension: 0.039" L x 0.020" W (1.00mm x 0.50mm); Height - Seated (Max): -; Thickness (Max): 0.022" (0.55mm); Lead Spacing: -; Lead Style: -
  C26: Voltage: 10V
C21 = GCM155R71E103KA37D: as C6 on sheet Sheet2; Datasheets: http://www.murata.com/~/media/webrenewal/support/library/catalog/products/capacitor/mlcc/c03e.ashx; Image: //media.digikey.com/Renders/Murata%20Renders/ZRB-SERIES-0402.jpg; Digi-Key Part Number: 490-6043-1-ND; Part Number: GCM155R71E103KA37D; Quantity Available: 128782; @ qty: 0; Packaging: Cut Tape (CT); Series: GCM; Part Status: Active; Value: 10000pF; Temperature Coefficient: X7R; Operating Temperature: -55°C ~ 125°C; Features: -; Ratings: AEC-Q200; Applications: Automotive; Mounting Type: Surface Mount, MLCC; Package / Case: 0402 (1005 Metric); Size / Dimension: 0.039" L x 0.020" W (1.00mm x 0.50mm); Height - Seated (Max): -; Thickness (Max): 0.022" (0.55mm); Lead Spacing: -; Lead Style: -
C23 = GCM1555C1H4R7CA16D: CAP CER 4.7PF 50V NP0 0402; Manufacturer: Murata Electronics North America; Factory Stock: 0; Unit Price (USD): 0.1; Minimum Quantity: 1; Tolerance: ±0.25pF; Temperature Coefficient: C0G, NP0; Datasheets: http://www.murata.com/~/media/webrenewal/support/library/catalog/products/capacitor/mlcc/c03e.ashx; Image: //media.digikey.com/Renders/Murata%20Renders/ZRB-SERIES-0402.jpg; Digi-Key Part Number: 490-12652-1-ND; Part Number: GCM1555C1H4R7CA16D; Quantity Available: 7400; @ qty: 0; Packaging: Cut Tape (CT); Series: GCM; Part Status: Active; Value: 4.7pF; Voltage: 50V; Operating Temperature: -55°C ~ 125°C; Features: -; Ratings: AEC-Q200; Applications: Automotive; Mounting Type: Surface Mount, MLCC; Package / Case: 0402 (1005 Metric); Size / Dimension: 0.039" L x 0.020" W (1.00mm x 0.50mm); Height - Seated (Max): -; Thickness (Max): 0.022" (0.55mm); Lead Spacing: -; Lead Style: -
C24 = GRM188R72A104KA35D: CAP CER 0.1UF 100V X7R 0603; Manufacturer: Murata Electronics North America; Factory Stock: 0; Unit Price (USD): 0.2; Minimum Quantity: 1; Tolerance: ±10%; Datasheets: http://www.murata.com/~/media/webrenewal/support/library/catalog/products/capacitor/mlcc/c02e.pdf; Image: //media.digikey.com/Renders/Murata%20Renders/ZRB-SERIES-0402.jpg; Digi-Key Part Number: 490-3285-1-ND; Part Number: GRM188R72A104KA35D; Quantity Available: 924944; @ qty: 0; Packaging: Cut Tape (CT); Series: GRM; Part Status: Active; Value: 0.10µF; Temperature Coefficient: X7R; Operating Temperature: -55°C ~ 125°C; Features: -; Ratings: -; Applications: General Purpose; Mounting Type: Surface Mount, MLCC; Package / Case: 0603 (1608 Metric); Size / Dimension: 0.063" L x 0.031" W (1.60mm x 0.80mm); Height - Seated (Max): -; Thickness (Max): 0.035" (0.90mm); Lead Spacing: -; Lead Style: -
C33 = T521W476M016ATE045: ESR: 45mohm
C43 = T521D226M050ATE090: ESR: 90mohm
L1 = XGL4020-331ME: DCR: 3.6mohm; Isat: 15.2A; Imax: 23A; SFR: 110MHz
L2 = 744314330: DCR: 9mohm; Isat: 8A; Imax: 9A; SFR: 65MHz; Tolerance: 20%
Q1 = NVTFWS003N04CTAG: Rds: 3.5mohm; Vgs: 20V; Power Dissipation: 3.2W; Id: 22A; VDS: 40V; Qg: 23nC; Ciss: 1600pF; Operating Temperature: -55°C ~ 175°C
R6 = ERJ-3BSJR15V: RES SMD 0.15 OHM 5% 1/4W 0603; Manufacturer: Panasonic Electronic Components; Factory Stock: 0; Unit Price (USD): 0.05207; @ qty: 1500; Minimum Quantity: 1; Power (Watts): 0.25W, 1/4W; Temperature Coefficient: ±300ppm/°C; Part Number: ERJ-3BSJR15V; Datasheets: https://industrial.panasonic.com/cdbs/www-data/pdf/RDA0000/AOA0000C239.pdf; Image: //media.digikey.com/Photos/Panasonic%20Photos/MFG_ERJ-P6W%20Series.jpg; Digi-Key Part Number: P17248CT-ND; Quantity Available: 4990; Packaging: Cut Tape (CT); Series: ERJ; Part Status: Active; Value: 0.15; Tolerance: ±5%; Composition: Thick Film; Features: Automotive AEC-Q200, Current Sense; Operating Temperature: -55°C ~ 125°C; Package / Case: 0603 (1608 Metric); Supplier Device Package: 0603; Size / Dimension: 0.063" L x 0.031" W (1.60mm x 0.80mm); Height - Seated (Max): 0.022" (0.55mm); Number of Terminations: 2; Failure Rate: -
R7 R11 = ERJ-2GEJ104X: as R26 on sheet Sheet1; Part Number: ERJ-2GEJ104X; Datasheets: http://industrial.panasonic.com/www-cgi/jvcr13pz.cgi?E+PZ+3+AOA0001+ERJ2GEJ104X+7+WW; Image: //media.digikey.com/Photos/Panasonic%20Photos/ERJ-PA2-Series.jpg; Digi-Key Part Number: P100KJCT-ND; Quantity Available: 2387986; Packaging: Cut Tape (CT); Series: ERJ; Part Status: Active; Value: 100k; Tolerance: ±5%; Composition: Thick Film; Features: Automotive AEC-Q200; Operating Temperature: -55°C ~ 155°C; Package / Case: 0402 (1005 Metric); Supplier Device Package: 0402; Size / Dimension: 0.039" L x 0.020" W (1.00mm x 0.50mm); Height - Seated (Max): 0.016" (0.40mm); Number of Terminations: 2; Failure Rate: -
R8 = ERJ-3LWFR005V: RES SMD 0.005 OHM 1% 1/4W 0603; Manufacturer: Panasonic Electronic Components; Factory Stock: 0; Unit Price (USD): 0.12384; @ qty: 1500; Minimum Quantity: 1; Power (Watts): 0.25W, 1/4W; Temperature Coefficient: 0/ +700ppm/°C; Part Number: ERJ-3LWFR005V; Datasheets: https://industrial.panasonic.com/cdbs/www-data/pdf/RDA0000/AOA0000C239.pdf; Image: //media.digikey.com/Photos/Panasonic%20Photos/MFG_ERJ-P6W%20Series.jpg; Digi-Key Part Number: P19182CT-ND; Quantity Available: 2588; Packaging: Cut Tape (CT); Series: ERJ; Part Status: Active; Value: 0.005; Tolerance: ±1%; Composition: Thick Film; Features: Automotive AEC-Q200, Current Sense; Operating Temperature: -55°C ~ 125°C; Package / Case: 0603 (1608 Metric); Supplier Device Package: 0603; Size / Dimension: 0.063" L x 0.031" W (1.60mm x 0.80mm); Height - Seated (Max): 0.026" (0.65mm); Number of Terminations: 2; Failure Rate: -
R9 R10 = ERJ-3RQF2R2V: RES SMD 2.2 OHM 1% 1/10W 0603; Manufacturer: Panasonic Electronic Components; Factory Stock: 0; Unit Price (USD): 0.03510; @ qty: 1500; Minimum Quantity: 1; Power (Watts): 0.1W, 1/10W; Temperature Coefficient: ±200ppm/°C; Part Number: ERJ-3RQF2R2V; Datasheets: https://industrial.panasonic.com/cdbs/www-data/pdf/RDA0000/AOA0000C239.pdf; Image: //media.digikey.com/Photos/Panasonic%20Photos/MFG_ERJ-P6W%20Series.jpg; Digi-Key Part Number: P2.2AJCT-ND; Quantity Available: 43930; Packaging: Cut Tape (CT); Series: ERJ; Part Status: Active; Value: 2.2; Tolerance: ±1%; Composition: Thick Film; Features: Automotive AEC-Q200, Current Sense; Operating Temperature: -55°C ~ 125°C; Package / Case: 0603 (1608 Metric); Supplier Device Package: 0603; Size / Dimension: 0.063" L x 0.031" W (1.60mm x 0.80mm); Height - Seated (Max): 0.022" (0.55mm); Number of Terminations: 2; Failure Rate: -
R12 = ERJ-2RKF1822X: RES SMD 18.2K OHM 1% 1/10W 0402; Manufacturer: Panasonic Electronic Components; Factory Stock: 0; Unit Price (USD): 0.00496; @ qty: 1500; Minimum Quantity: 1; Power (Watts): 0.1W, 1/10W; Temperature Coefficient: ±100ppm/°C; Part Number: ERJ-2RKF1822X; Datasheets: http://industrial.panasonic.com/www-cgi/jvcr13pz.cgi?E+PZ+3+AOA0002+ERJ2RKF1822X+7+WW; Image: //media.digikey.com/Photos/Panasonic%20Photos/ERJ-PA2-Series.jpg; Digi-Key Part Number: P18.2KLCT-ND; Quantity Available: 142975; Packaging: Cut Tape (CT); Series: ERJ; Part Status: Active; Value: 18.2k; Tolerance: ±1%; Composition: Thick Film; Features: Automotive AEC-Q200; Operating Temperature: -55°C ~ 155°C; Package / Case: 0402 (1005 Metric); Supplier Device Package: 0402; Size / Dimension: 0.039" L x 0.020" W (1.00mm x 0.50mm); Height - Seated (Max): 0.016" (0.40mm); Number of Terminations: 2; Failure Rate: -
R13 = ERJ-PB6B1004V: RES SMD 1M OHM 0.1% 1/4W 0805; Manufacturer: Panasonic Electronic Components; Factory Stock: 0; Unit Price (USD): 0.04554; @ qty: 1000; Minimum Quantity: 1; Power (Watts): 0.25W, 1/4W; Temperature Coefficient: ±50ppm/°C; Part Number: ERJ-PB6B1004V; Datasheets: https://industrial.panasonic.com/cdbs/www-data/pdf/RDA0000/AOA0000C100.pdf; Image: //media.digikey.com/Renders/Panasonic%20Renders/ERJ-0805%20Pkg.jpg; Digi-Key Part Number: P20936CT-ND; Quantity Available: 10000; Packaging: Cut Tape (CT); Series: ERJ; Part Status: Active; Value: 1M; Composition: Thick Film; Features: Automotive AEC-Q200, Pulse Withstanding; Operating Temperature: -55°C ~ 155°C; Package / Case: 0805 (2012 Metric); Supplier Device Package: 0805; Size / Dimension: 0.079" L x 0.049" W (2.00mm x 1.25mm); Height - Seated (Max): 0.028" (0.70mm); Number of Terminations: 2; Failure Rate: -
R14 = ERJ-PB6B2323V: RES SMD 232k OHM 0.1% 1/4W 0805; Manufacturer: Panasonic Electronic Components; Factory Stock: 0; Unit Price (USD): 0.04554; @ qty: 1000; Minimum Quantity: 1; Power (Watts): 0.25W, 1/4W; Temperature Coefficient: ±50ppm/°C; Part Number: ERJ-PB6B2323V; Datasheets: https://industrial.panasonic.com/cdbs/www-data/pdf/RDA0000/AOA0000C100.pdf; Image: //media.digikey.com/Renders/Panasonic%20Renders/ERJ-0805%20Pkg.jpg; Digi-Key Part Number: P20861CT-ND; Quantity Available: 10000; Packaging: Cut Tape (CT); Series: ERJ; Part Status: Active; Value: 232k; Composition: Thick Film; Features: Automotive AEC-Q200, Pulse Withstanding; Operating Temperature: -55°C ~ 155°C; Package / Case: 0805 (2012 Metric); Supplier Device Package: 0805; Size / Dimension: 0.079" L x 0.049" W (2.00mm x 1.25mm); Height - Seated (Max): 0.028" (0.70mm); Number of Terminations: 2; Failure Rate: -
R15 = ERJ-2GEJ101X: RES SMD 100 OHM 5% 1/10W 0402; Manufacturer: Panasonic Electronic Components; Factory Stock: 0; Unit Price (USD): 0.00350; @ qty: 1500; Minimum Quantity: 1; Power (Watts): 0.1W, 1/10W; Temperature Coefficient: ±200ppm/°C; Part Number: ERJ-2GEJ101X; Datasheets: http://industrial.panasonic.com/www-cgi/jvcr13pz.cgi?E+PZ+3+AOA0001+ERJ2GEJ101X+7+WW; Image: //media.digikey.com/Photos/Panasonic%20Photos/ERJ-PA2-Series.jpg; Digi-Key Part Number: P100JCT-ND; Quantity Available: 3114113; Packaging: Cut Tape (CT); Series: ERJ; Part Status: Active; Value: 100; Tolerance: ±5%; Composition: Thick Film; Features: Automotive AEC-Q200; Operating Temperature: -55°C ~ 155°C; Package / Case: 0402 (1005 Metric); Supplier Device Package: 0402; Size / Dimension: 0.039" L x 0.020" W (1.00mm x 0.50mm); Height - Seated (Max): 0.016" (0.40mm); Number of Terminations: 2; Failure Rate: -
R35 = ERJ-2GEJ100X: RES SMD 10 OHM 5% 1/10W 0402; Manufacturer: Panasonic Electronic Components; Factory Stock: 0; Unit Price (USD): 0.00350; @ qty: 1500; Minimum Quantity: 1; Power (Watts): 0.1W, 1/10W; Temperature Coefficient: ±200ppm/°C; Part Number: ERJ-2GEJ100X; Datasheets: http://industrial.panasonic.com/www-cgi/jvcr13pz.cgi?E+PZ+3+AOA0001+ERJ2GEJ100X+7+WW; Image: //media.digikey.com/Photos/Panasonic%20Photos/ERJ-PA2-Series.jpg; Digi-Key Part Number: P10JCT-ND; Quantity Available: 1054751; Packaging: Cut Tape (CT); Series: ERJ; Part Status: Active; Value: 10; Tolerance: ±5%; Composition: Thick Film; Features: Automotive AEC-Q200; Operating Temperature: -55°C ~ 155°C; Package / Case: 0402 (1005 Metric); Supplier Device Package: 0402; Size / Dimension: 0.039" L x 0.020" W (1.00mm x 0.50mm); Height - Seated (Max): 0.016" (0.40mm); Number of Terminations: 2; Failure Rate: -